# EAGLE design aux1.96 (EAGLE 6.5.0)
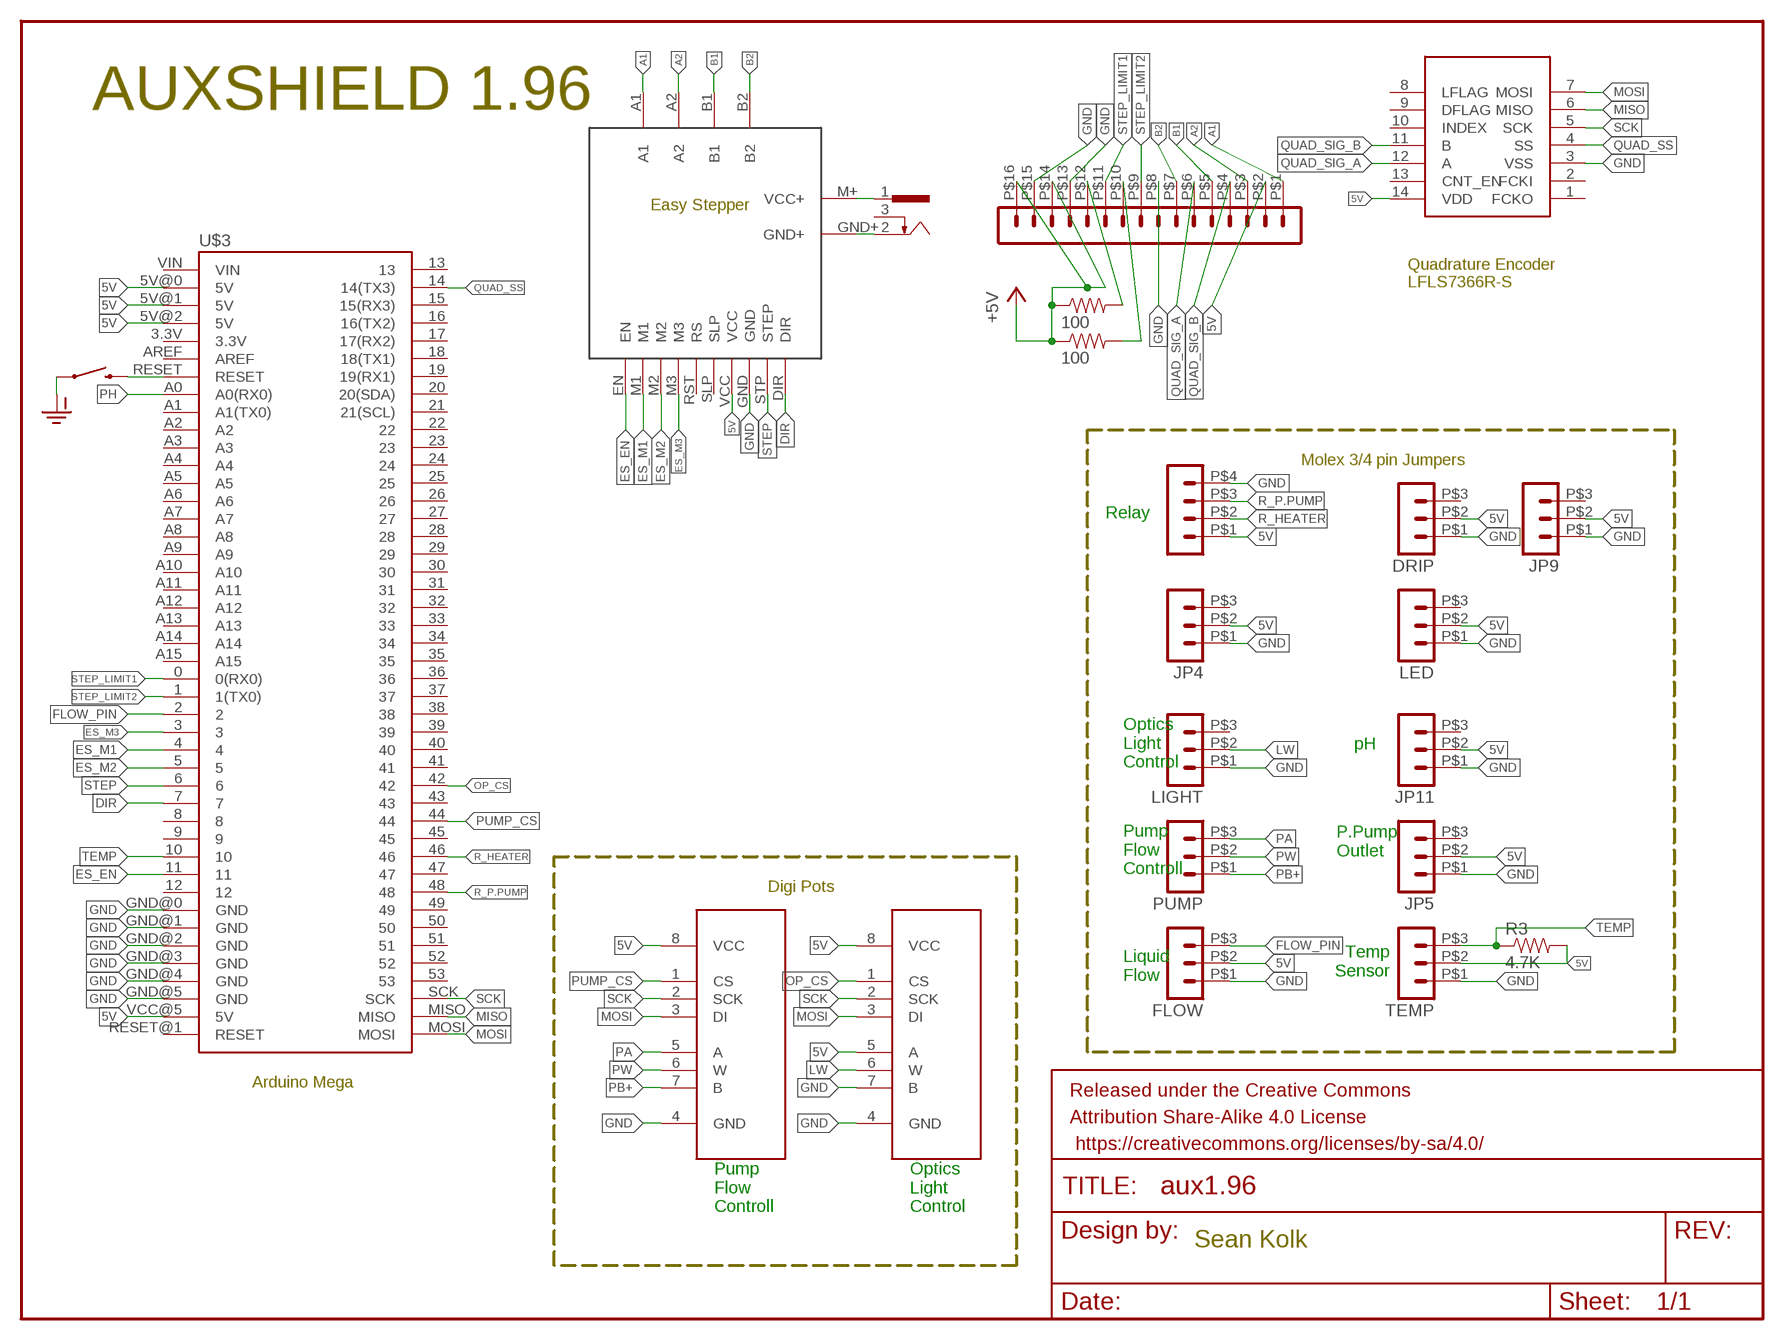
[diagram p0: schematic, sheet 1]

## Parts
DRIP  HEADER_POS3_43650-0315  [43650-0315]
FLOW  HEADER_POS3_43650-0315  [43650-0315]
FRAME1  FRAME-LETTER  [CREATIVE_COMMONS]
JP4  HEADER_POS3_43650-0315  [43650-0315]
JP5  HEADER_POS3_43650-0315  [43650-0315]
JP9  HEADER_POS3_43650-0315  [43650-0315]
JP11  HEADER_POS3_43650-0315  [43650-0315]
LED  HEADER_POS3_43650-0315  [43650-0315]
LIGHT  HEADER_POS3_43650-0315  [43650-0315]
PUMP  HEADER_POS3_43650-0315  [43650-0315]
PUMPDIGIPOT  MCP41XXXDIL  [DIL-08]
R1  100  10OHM-1/4W-5%(PTH)  [AXIAL-0.3]
R3  4.7K  10OHM-1/4W-5%(PTH)  [AXIAL-0.3]
R4  100  10OHM-1/4W-5%(PTH)  [AXIAL-0.3]
RELAY  HEADER_POS4_44914-0401  [44914-0401]
S1  SWITCH-MOMENTARY-2PTH_EZ  [TACTILE-PTH-EZ]
TEMP  HEADER_POS3_43650-0315  [43650-0315]
U1  MCP41XXXDIL  [DIL-08]
U$1  HEADER_POS16_43045-1612  [43045-1612]
U$2  LS7366R  [SO014]
U$3  ARDUINO-MEGA-V2  [ARDUINO_MEGA-PRO-5V]
U$4  BIG_EASY_DRIVER  [BIG_EASY_DRIVER_PACK]
X1  SCD-014A  [SCD-014-A]

## Nets
5V: DRIP.P$2 FLOW.P$2 JP4.P$2 JP5.P$2 JP9.P$2 JP11.P$2 LED.P$2 PUMPDIGIPOT.8(VCC) R1.P$1 R3.P$2 R4.P$1 RELAY.P$1 TEMP.P$2 U1.5(A) U1.8(VCC) U$1.P$2 U$1.P$14 U$1.P$16 U$2.14(VDD) U$3.5V@0(5V) U$3.5V@1(5V) U$3.5V@2(5V) U$3.VCC@5(5V) U$4.VCC ; supply symbol labelled +5V
A1: U$1.P$1 U$4.A1
A2: U$1.P$3 U$4.A2
B1: U$1.P$5 U$4.B1
B2: U$1.P$7 U$4.B2
DIR: U$3.7 U$4.DIR
ES_EN: U$3.11 U$4.EN
ES_M1: U$3.4 U$4.M1
ES_M2: U$3.5 U$4.M2
ES_M3: U$3.3 U$4.M3
FLOW_PIN: FLOW.P$3 U$3.2
GND: DRIP.P$1 FLOW.P$1 JP4.P$1 JP5.P$1 JP9.P$1 JP11.P$1 LED.P$1 LIGHT.P$1 PUMPDIGIPOT.4(GND) RELAY.P$4 S1.1 TEMP.P$1 U1.4(GND) U1.7(B) U$1.P$8 U$1.P$13 U$1.P$15 U$2.3(VSS) U$3.GND@0(GND) U$3.GND@1(GND) U$3.GND@2(GND) U$3.GND@3(GND) U$3.GND@4(GND) U$3.GND@5(GND) U$4.GND ; supply symbol labelled GND-ISO
LW: LIGHT.P$2 U1.6(W)
MISO: U$2.6(MISO) U$3.MISO
MOSI: PUMPDIGIPOT.3(DI) U1.3(DI) U$2.7(MOSI) U$3.MOSI
N$1: U$4.M+(VCC+) X1.1
N$2: U$4.GND+ X1.2
N$4: R1.P$2 U$1.P$10
N$9: S1.3 U$3.RESET
N$33: R4.P$2 U$1.P$12
OP_CS: U1.1(CS) U$3.42
PA: PUMP.P$3 PUMPDIGIPOT.5(A)
PB+: PUMP.P$1 PUMPDIGIPOT.7(B)
PH: U$3.A0(A0(RX0))
PUMP_CS: PUMPDIGIPOT.1(CS) U$3.44
PW: PUMP.P$2 PUMPDIGIPOT.6(W)
QUAD_SIG_A: U$1.P$6 U$2.12(A)
QUAD_SIG_B: U$1.P$4 U$2.11(B)
QUAD_SS: U$2.4(SS) U$3.14(14(TX3))
R_HEATER: RELAY.P$2 U$3.46
R_P.PUMP: RELAY.P$3 U$3.48
SCK: PUMPDIGIPOT.2(SCK) U1.2(SCK) U$2.5(SCK) U$3.SCK
STEP: U$3.6 U$4.STP(STEP)
STEP_LIMIT1: U$1.P$11 U$3.0(0(RX0))
STEP_LIMIT2: U$1.P$9 U$3.1(1(TX0))
TEMP: R3.P$1 TEMP.P$3 U$3.10
Unconnected: DRIP.P$3 JP4.P$3 JP5.P$3 JP9.P$3 JP11.P$3 LED.P$3 LIGHT.P$3 U$2.1(FCKO) U$2.2(FCKI) U$2.8(LFLAG) U$2.9(DFLAG) U$2.10(INDEX) U$2.13(CNT_EN) U$3.3.3V U$3.8 U$3.9 U$3.12 U$3.13 U$3.15(15(RX3)) U$3.16(16(TX2)) U$3.17(17(RX2)) U$3.18(18(TX1)) U$3.19(19(RX1)) U$3.20(20(SDA)) U$3.21(21(SCL)) U$3.22 U$3.23 U$3.24 U$3.25 U$3.26 U$3.27 U$3.28 U$3.29 U$3.30 U$3.31 U$3.32 U$3.33 U$3.34 U$3.35 U$3.36 U$3.37 U$3.38 U$3.39 U$3.40 U$3.41 U$3.43 U$3.45 U$3.47 U$3.49 U$3.50 U$3.51 U$3.52 U$3.53 U$3.A1(A1(TX0)) U$3.A2 U$3.A3 U$3.A4 U$3.A5 U$3.A6 U$3.A7 U$3.A8 U$3.A9 U$3.A10 U$3.A11 U$3.A12 U$3.A13 U$3.A14 U$3.A15 U$3.AREF U$3.RESET@1(RESET) U$3.VIN U$4.RST(RS) U$4.SLP X1.3

## Notes on the sheet
- AUXSHIELD 1.96
- Easy Stepper
- Quadrature Encoder
  LFLS7366R-S
- Molex 3/4 pin Jumpers
- Relay
- pH
- Optics
  Light 
  Control
- P.Pump 
  Outlet
- Pump
  Flow
  Controll
- Digi Pots
- Temp
  Sensor
- Liquid 
  Flow
- Arduino Mega
- Pump
  Flow
  Controll
- Optics
  Light
  Control
- Sean Kolk

## Library data of the parts
DRIP FLOW JP4 JP5 JP9 JP11 LED LIGHT PUMP TEMP = con-molex-micro-fit-3_0:HEADER_POS3_?: Molex - Micro-Fit 3.0 Series connector, 3.00mm (0.118") pitch header, 3 positions.
FRAME1 = SparkFun-Aesthetics:FRAME-LETTER: Schematic Frame Standard 8.5x11 US Letter frame
PUMPDIGIPOT U1 = SparkFun-AnalogIC:MCP41XXX: SPI controlled single digital potentiometer by Microchip PID: COM-10613
R1 R3 R4 = SparkFun-Resistors:10OHM-1/4W-5%(PTH): RES-10698; PROD_ID: RES-10698; VALUE: 10
RELAY = con-molex-micro-fit-3_0:HEADER_POS4_?: Molex - Micro-Fit 3.0 Series connector, 3.00mm (0.118") pitch header, 4 positions.
S1 = SparkFun-Electromechanical:SWITCH-MOMENTARY-2: Various NO switches- pushbuttons, reed, etc
U$1 = con-molex-micro-fit-3_0:HEADER_POS16_?: Molex - Micro-Fit 3.0 Series connector, 3.00mm (0.118") pitch header, 16 positions.
U$2 = SparkFun-DigitalIC:LS7366R
U$3 = MEGASHIELD2:ARDUINO-MEGA-V2
U$4 = SparkFun-Boards:BIG_EASY_DRIVER
X1 = con-shiua-chyuan:SCD-014A: Power Jack 2.5mm; OC_FARNELL: unknown; OC_NEWARK: unknown

## Board
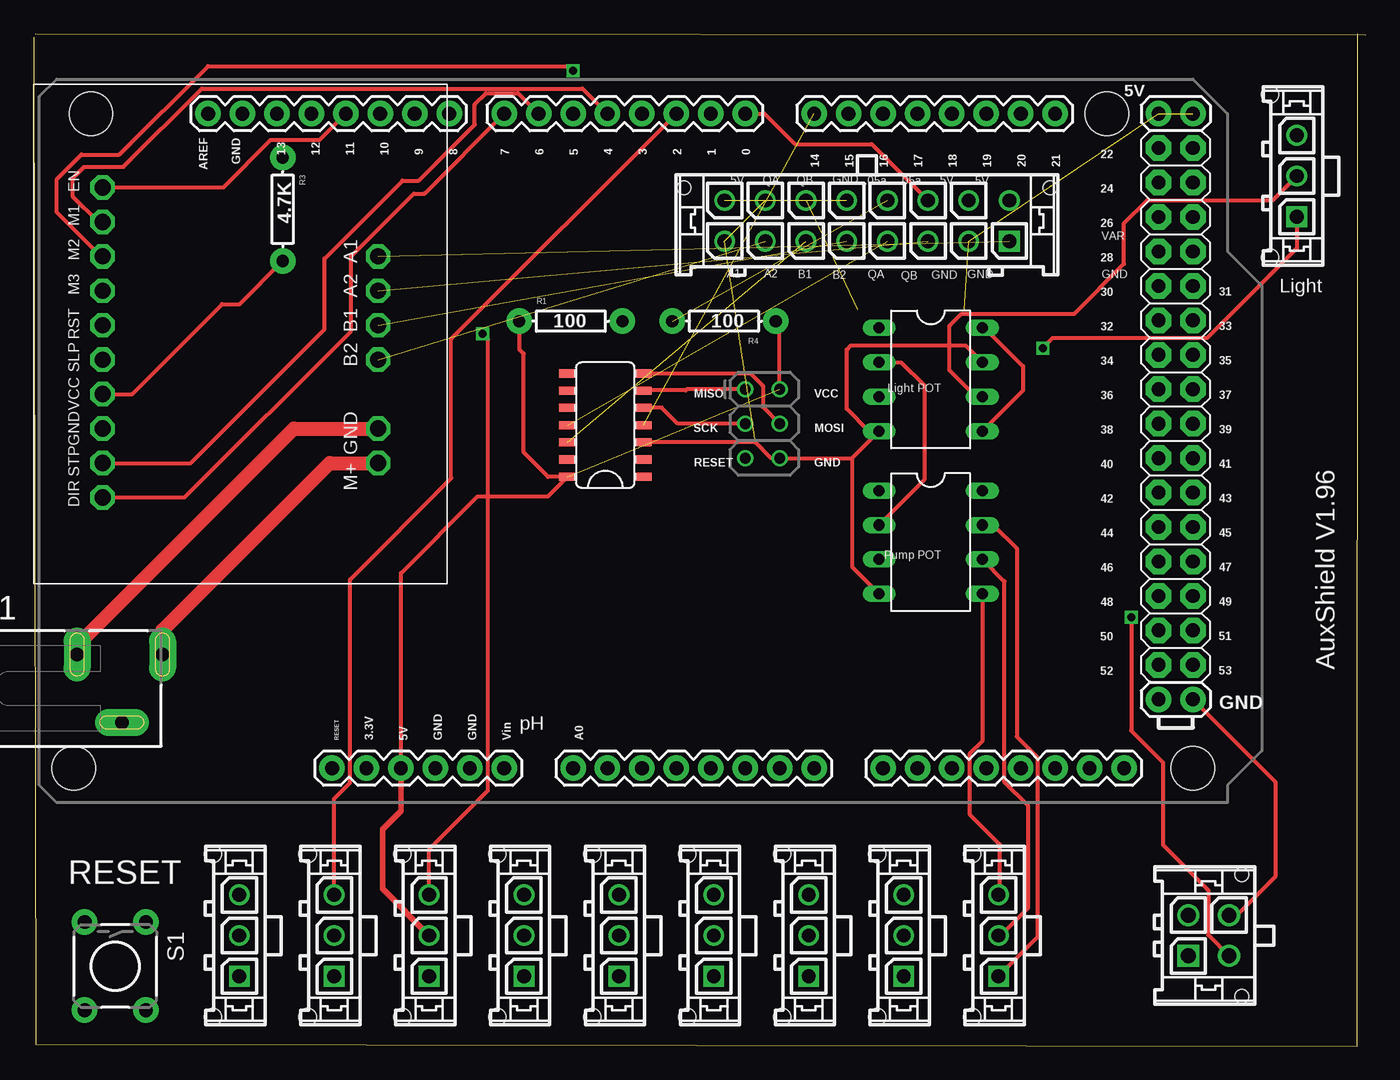
[diagram p1: board, top side]
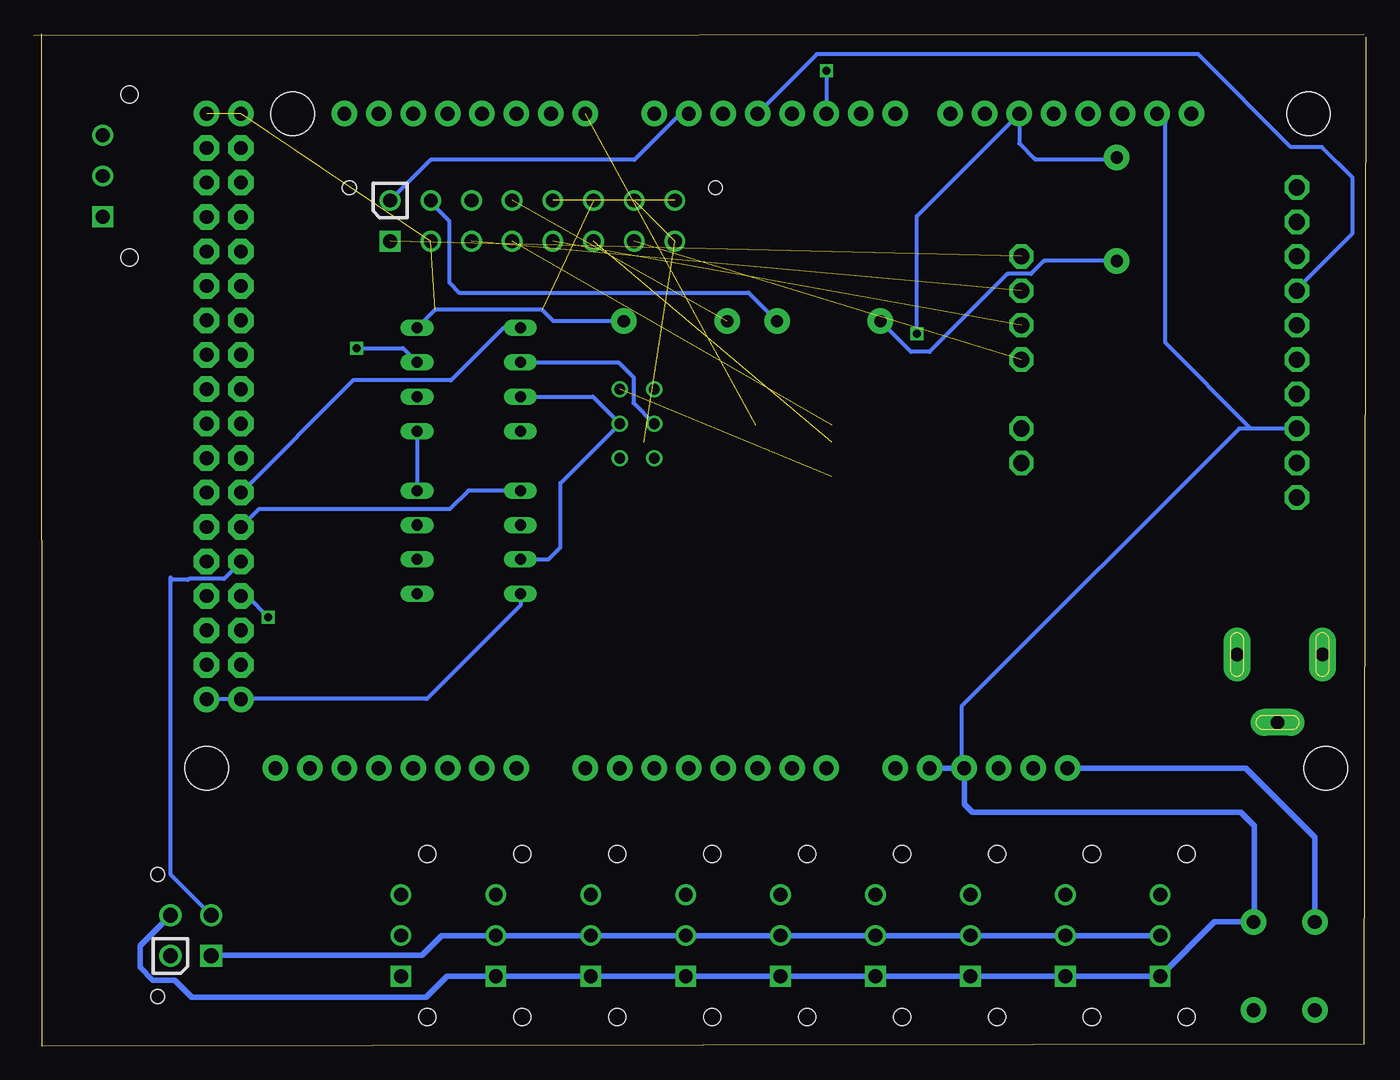
[diagram p2: board, bottom side, seen from below]

Size 98.23 x 74.63 mm. Coordinates in mm from the lower left corner, seen from the top.
Outline: 97.65,74.63 97.6,0 0.15,0.15 0,74.38
Outline: 98.23,74.54 0.15,74.59
Copper layers (1*16): Top 0.0356mm / dielectric 1.5011mm / Bottom 0.0356mm
Design rules "oshpark-2layer (1)": minimum track width 6mil, minimum drill 13mil, track to track 6mil, track to pad 6mil, pad to pad 6mil, via to via 6mil, smd to smd 6mil, copper to edge 15mil, drill to drill 6mil, minimum pad ring 7mil, minimum via ring 7mil, stop-mask expansion 4mil, vias tented up to drill 0mil, thermal gap 10mil

### Footprints (pad centres in the part's own frame; a part is rotated, then mirrored left to right if it is on the bottom)
43650-0315 = drill 1.02 square: P$1 3,0 | drill 1.02: P$2 0,0; P$3 -3,0 | hole 1.27: 6,-1.96; -6,-1.96
DIL-08 = drill 0.813 long: 1 -3.81,-3.81; 2 -1.27,-3.81; 3 1.27,-3.81; 4 3.81,-3.81; 5 3.81,3.81; 6 1.27,3.81; 7 -1.27,3.81; 8 -3.81,3.81
AXIAL-0.3 = drill 0.9 pad 1.88: P$1 -3.81,0; P$2 3.81,0
44914-0401 = drill 1.09 square: P$1 1.5,0 | drill 1.09: P$2 -1.5,0; P$3 1.5,3; P$4 -1.5,3 | hole 1.02: 4.5,3.94; -4.5,3.94
TACTILE-PTH-EZ = drill 1.016 pad 1.88: 1 -3.251,2.261; 2 3.251,2.261; 3 -3.251,-2.261; 4 3.251,-2.261
43045-1612 = drill 1.02 square: P$1 10.5,0 | drill 1.02: P$2 7.5,0; P$3 4.5,0; P$4 1.5,0; P$5 -1.5,0; P$6 -4.5,0; P$7 -7.5,0; P$8 -10.5,0; P$9 10.5,3; P$10 7.5,3; P$11 4.5,3; P$12 1.5,3; P$13 -1.5,3; P$14 -4.5,3; P$15 -7.5,3; P$16 -10.5,3 | hole 1.02: 13.5,3.94; -13.5,3.94
SO014 = smd 0.6 x 1.2: 1 -3.175,-2.8; 2 -1.905,-2.8; 3 -0.635,-2.8; 4 0.635,-2.8; 5 1.905,-2.8; 6 3.175,-2.8; 7 4.445,-2.8; 8 4.445,2.8; 9 3.175,2.8; 10 1.905,2.8; 11 0.635,2.8; 12 -0.635,2.8; 13 -1.905,2.8; 14 -3.175,2.8
ARDUINO_MEGA-PRO-5V = drill 1.016 pad 1.88: 0 52.07,50.8; 1 49.53,50.8; 2 46.99,50.8; 3 44.45,50.8; 3.3V 24.13,2.54; 4 41.91,50.8; 5 39.37,50.8; 5V@0 26.67,2.54; 5V@1 82.55,50.8; 5V@2 85.09,50.8; 6 36.83,50.8; 7 34.29,50.8; 8 30.226,50.8; 9 27.686,50.8; 10 25.146,50.8; 11 22.606,50.8; 12 20.066,50.8; 13 17.526,50.8; 14 57.15,50.8; 15 59.69,50.8; 16 62.23,50.8; 17 64.77,50.8; 18 67.31,50.8; 19 69.85,50.8; 20 72.39,50.8; 21 74.93,50.8; A0 39.37,2.54; A1 41.91,2.54; A2 44.45,2.54; A3 46.99,2.54; A4 49.53,2.54; A5 52.07,2.54; A6 54.61,2.54; A7 57.15,2.54; A8 62.23,2.54; A9 64.77,2.54; A10 67.31,2.54; A11 69.85,2.54; A12 72.39,2.54; A13 74.93,2.54; A14 77.47,2.54; A15 80.01,2.54; AREF 12.446,50.8; GND@0 29.21,2.54; GND@1 31.75,2.54; GND@2 82.55,7.62; GND@3 85.09,7.62; GND@4 14.986,50.8; RESET 21.59,2.54; VIN 34.29,2.54 | drill 1.016 pad 1.88 octagon: 22 82.55,48.26; 23 85.09,48.26; 24 82.55,45.72; 25 85.09,45.72; 26 82.55,43.18; 27 85.09,43.18; 28 82.55,40.64; 29 85.09,40.64; 30 82.55,38.1; 31 85.09,38.1; 32 82.55,35.56; 33 85.09,35.56; 34 82.55,33.02; 35 85.09,33.02; 36 82.55,30.48; 37 85.09,30.48; 38 82.55,27.94; 39 85.09,27.94; 40 82.55,25.4; 41 85.09,25.4; 42 82.55,22.86; 43 85.09,22.86; 44 82.55,20.32; 45 85.09,20.32; 46 82.55,17.78; 47 85.09,17.78; 48 82.55,15.24; 49 85.09,15.24; 50 82.55,12.7; 51 85.09,12.7; 52 82.55,10.16; 53 85.09,10.16 | drill 0.8: GND@5 54.61,25.4; MISO 52.07,30.48; MOSI 54.61,27.94; RESET@1 52.07,25.4; SCK 52.07,27.94; VCC@5 54.61,30.48 | hole 3.2: 3.81,50.8; 2.54,2.54; 78.74,50.8; 85.09,2.54
BIG_EASY_DRIVER_PACK = drill 1.2 octagon: A1 -5.08,15.24; A2 -2.54,15.24; B1 0,15.24; B2 2.54,15.24; DIR 12.7,-5.08; EN -10.16,-5.08; GND 7.62,-5.08; GND+ 7.62,15.24; M1 -7.62,-5.08; M2 -5.08,-5.08; M3 -2.54,-5.08; M+ 10.16,15.24; RST 0,-5.08; SLP 2.54,-5.08; STP 10.16,-5.08; VCC 5.08,-5.08
SCD-014-A = drill 1 pad 2 long: 1 -2.5,13.8; 2 -2.5,7.5; 3 2.5,10.8

### Placement (x,y rotation side)
DRIP  64.15,8.15 270 top
FLOW  22.15,8.15 270 top
FRAME1  5.25,-14.8 0 top  (outside the outline)
JP4  50.15,8.15 270 top
JP5  43.15,8.15 270 top
JP9  36.15,8.15 270 top
JP11  15.15,8.15 270 top
LED  57.15,8.15 270 top
LIGHT  93.15,64.15 270 top
PUMP  71.15,8.15 270 top
PUMPDIGIPOT  66.15,37.15 270 top
R1  39.6,53.45 0 top
R3  18.35,61.7 270 top
R4  50.9,53.45 180 top
RELAY  85.15,8.15 270 top
S1  6,5.9 270 top
TEMP  29.15,8.15 270 top
U1  66.15,49.15 270 top
U$1  61.45,59.35 0 top
U$2  42.15,45.15 90 top
U$3  0.4,17.95 0 top
U$4  10.15,53.15 270 top
X1  -4.31,26.37 270 top

### Tracks (layer width: path | path; a pad name or v marks a point on that pad's centre or on a via)
5V  (6 unrouted)
  Top 0.305: U1.8 70.12,52.96 72.95,50.13 72.95,48.33 U1.5 | U$4.VCC 7.24,48.07 13.87,54.7 15.16,54.7 R3.P$2 | U$3.5V@0 27.07,34.88 32.73,40.54 37.91,40.54 U$2.14 37.91,41.98 36.12,43.77 36.12,51.05 35.81,51.36 35.81,53.43 R1.P$1 | U$3.VCC@5 55.01,53.15 R4.P$1
  Top 0.406: U$3.5V@0 27.07,17.36 25.71,16 25.71,11.59 TEMP.P$2
  Bottom 0.305: U1.5 PUMPDIGIPOT.8 | R3.P$2 23.73,57.89 24.68,56.94 26.42,56.94 32.17,51.19 33.53,51.19 R1.P$1 | R4.P$1 59.9,53.45 60.74,54.29 68.63,54.29 U1.8
  Bottom 0.406: JP11.P$2 FLOW.P$2 TEMP.P$2 JP9.P$2 JP5.P$2 JP4.P$2 LED.P$2 63.58,8.15 63.63,8.1 64.1,8.1 DRIP.P$2 68.14,8.15 69.59,6.7 85.1,6.7 RELAY.P$1
A1  (1 unrouted)
A2  (1 unrouted)
B1  (1 unrouted)
B2  (1 unrouted)
DIR
  Top 0.305: U$4.DIR 11.12,40.45 23.39,52.72 23.39,58.24 28.01,62.86 28.8,62.86 U$3.7
ES_EN
  Top 0.305: U$4.EN 13.98,63.31 17.48,66.81 21.07,66.81 U$3.11
ES_M1
  Top 0.305: U$4.M1 4.74,60.77 2.88,62.63 2.88,63.99 3.71,64.82 6.6,64.82 12.38,70.6 40.46,70.6 U$3.4
ES_M2  (via drill 0.6)
  Top 0.305: U$4.M2 4.94,58.23 1.7,61.47 1.7,63.92 3.5,65.72 6.31,65.72 12.84,72.25 39.44,72.25 v39.77,71.92
  Bottom 0.305: v39.77,71.92 U$3.5
ES_M3
  Bottom 0.305: U$4.M3 5.07,55.82 0.95,59.94 0.95,64.02 3.22,66.29 5.51,66.29 12.35,73.13 40.47,73.13 U$3.3
FLOW_PIN
  Top 0.305: FLOW.P$3 22.15,18.25 23.31,19.41 23.31,34.4 30.78,41.87 30.78,52.14 U$3.2
GND  (via drill 0.6)  (3 unrouted)
  Top 0.305: U$2.3 53.21,44.51 54.37,43.35 U$3.GND@5 60.35,43.35 | 60.35,43.35 U1.4 61.61,45.34 59.97,46.98 59.97,51.36 60.28,51.67 68.71,51.67 U1.7 | RELAY.P$4 88.71,9.65 91.6,12.54 91.6,19.46 U$3.GND@3 | LIGHT.P$1 93.15,58.82 86.52,52.19 75.14,52.19 v74.41,51.46 | 60.35,43.35 60.35,35.33 PUMPDIGIPOT.4
  Bottom 0.305: PUMPDIGIPOT.4 62.34,32.49 69.23,25.6 82.92,25.6 U$3.GND@2 U$3.GND@3 | v74.41,51.46 71,51.46 U1.7 | U$4.GND 8.46,45.53 | 8.46,45.53 14.77,51.84 14.77,68.13 U$3.GND@4 | 8.46,45.53 9.33,45.53 29.81,25.05 29.81,20.69 U$3.GND@0
  Bottom 0.406: RELAY.P$4 90.4,7.4 90.4,5.8 89.47,4.87 87.85,4.87 86.59,3.61 69.3,3.61 67.76,5.15 DRIP.P$1 LED.P$1 JP4.P$1 JP5.P$1 JP9.P$1 TEMP.P$1 FLOW.P$1 JP11.P$1 11.15,9.15 S1.1 8.22,9.19 8.22,16.25 9.2,17.23 29.01,17.23 29.61,17.83 U$3.GND@0 U$3.GND@1
LW
  Top 0.305: U1.6 69.48,47.88 67.54,49.82 67.54,53.1 68.43,53.99 76.73,53.99 80.41,57.67 80.41,60.66 82.13,62.38 91.38,62.38 LIGHT.P$2
MISO
  Top 0.305: U$3.MISO 48.18,48.43 48.09,48.34 44.96,48.34 U$2.6
MOSI
  Top 0.305: U$2.7 52.85,49.59 53.77,48.68 53.77,47.13 U$3.MOSI
  Bottom 0.305: U1.3 57,47.88 U$3.MOSI 59.39,41.51 59.39,36.77 60.28,35.88 PUMPDIGIPOT.3
N$1
  Top 1.016: X1.1 9.49,30.66 21.82,42.99 U$4.M+
N$2
  Top 1.016: X1.2 3.19,29.55 19.16,45.52 U$4.GND+
N$4
  Bottom 0.305: U$1.P$10 68.95,62.2 67.6,60.85 67.6,56.31 66.85,55.56 45.52,55.56 R1.P$2
N$9
  Bottom 0.406: S1.3 3.74,15.39 8.84,20.49 U$3.RESET
N$33  (1 unrouted)
OP_CS
  Bottom 0.305: U1.1 63.58,52.96 67.46,49.08 74.68,49.08 U$3.42
PA
  Top 0.305: PUMPDIGIPOT.5 69.96,22.49 69.02,21.55 69.02,17.1 71.23,14.89 71.23,11.23 PUMP.P$3
PB+
  Top 0.305: PUMPDIGIPOT.7 70.76,38.42 72.49,36.69 72.49,22.82 74.01,21.3 74.01,8.01 PUMP.P$1
PUMP_CS
  Bottom 0.305: PUMPDIGIPOT.1 66.18,40.96 67.55,39.59 81.63,39.59 U$3.44
PW
  Top 0.305: PUMP.P$2 71.3,8.15 73.35,10.2 73.35,17.71 71.59,19.47 71.59,34.25 PUMPDIGIPOT.6
QUAD_SIG_A  (1 unrouted)
QUAD_SIG_B  (1 unrouted)
QUAD_SS  (1 unrouted)
R_HEATER
  Bottom 0.305: U$3.46 82.95,35.7 84.2,34.45 86.78,34.45 86.85,34.38 87.99,34.38 88.17,34.56 88.17,12.67 RELAY.P$2
R_P.PUMP  (via drill 0.6)
  Top 0.305: v80.94,31.63 80.94,23.25 83.27,20.92 83.27,14.84 86.61,11.5 86.61,8.19 RELAY.P$3
  Bottom 0.305: U$3.48 82.5,33.19 v80.94,31.63
SCK
  Top 0.305: U$3.SCK 47.48,45.89 46.3,47.07 44.96,47.07 U$2.5 | U1.2 63.97,50.42 65.67,48.72 65.67,41.75 PUMPDIGIPOT.2
  Bottom 0.305: U1.2 55.12,50.42 54,49.3 54,47.42 U$3.SCK
STEP
  Top 0.305: U$4.STP 11.57,42.99 21.43,52.85 21.43,58.06 27.18,63.81 28.39,63.81 32.52,67.94 32.52,69.44 33.35,70.27 35.71,70.27 U$3.6
STEP_LIMIT1
  Top 0.305: U$3.0 53.87,68.75 56.12,66.5 61.8,66.5 U$1.P$11
STEP_LIMIT2
  Bottom 0.305: U$3.1 50.52,68.75 53.93,65.34 68.96,65.34 U$1.P$9
TEMP  (via drill 0.6)
  Top 0.305: TEMP.P$3 29.15,14.5 33.5,18.85 33.5,52.12 v33.1,52.52
  Bottom 0.305: v33.1,52.52 33.1,61.2 U$3.10 25.55,66.56 24.39,65.4 18.46,65.4 R3.P$1

### Text on the board
tPlace: 5V | QA | QB | GND | .05a | .05a | 5V | 5V | VAR | A1 | A2 | B1 | B2 | QA | QB | GND | GND | GND | Light | Light POT | Pump POT | GND | AuxShield V1.96 | SIG | SIG | SIG | NS | SIG | 5V | pH | 5V | 5V | 5V | VAR | 5V | SIG | 5V | GND | GND | GND | GND | GND | Flow | Temp | p.p VCC | Relay | Pump | RESET
DrillLegend_01-16: 01-16